# EAGLE schematic mega2560 (EAGLE 5.11)
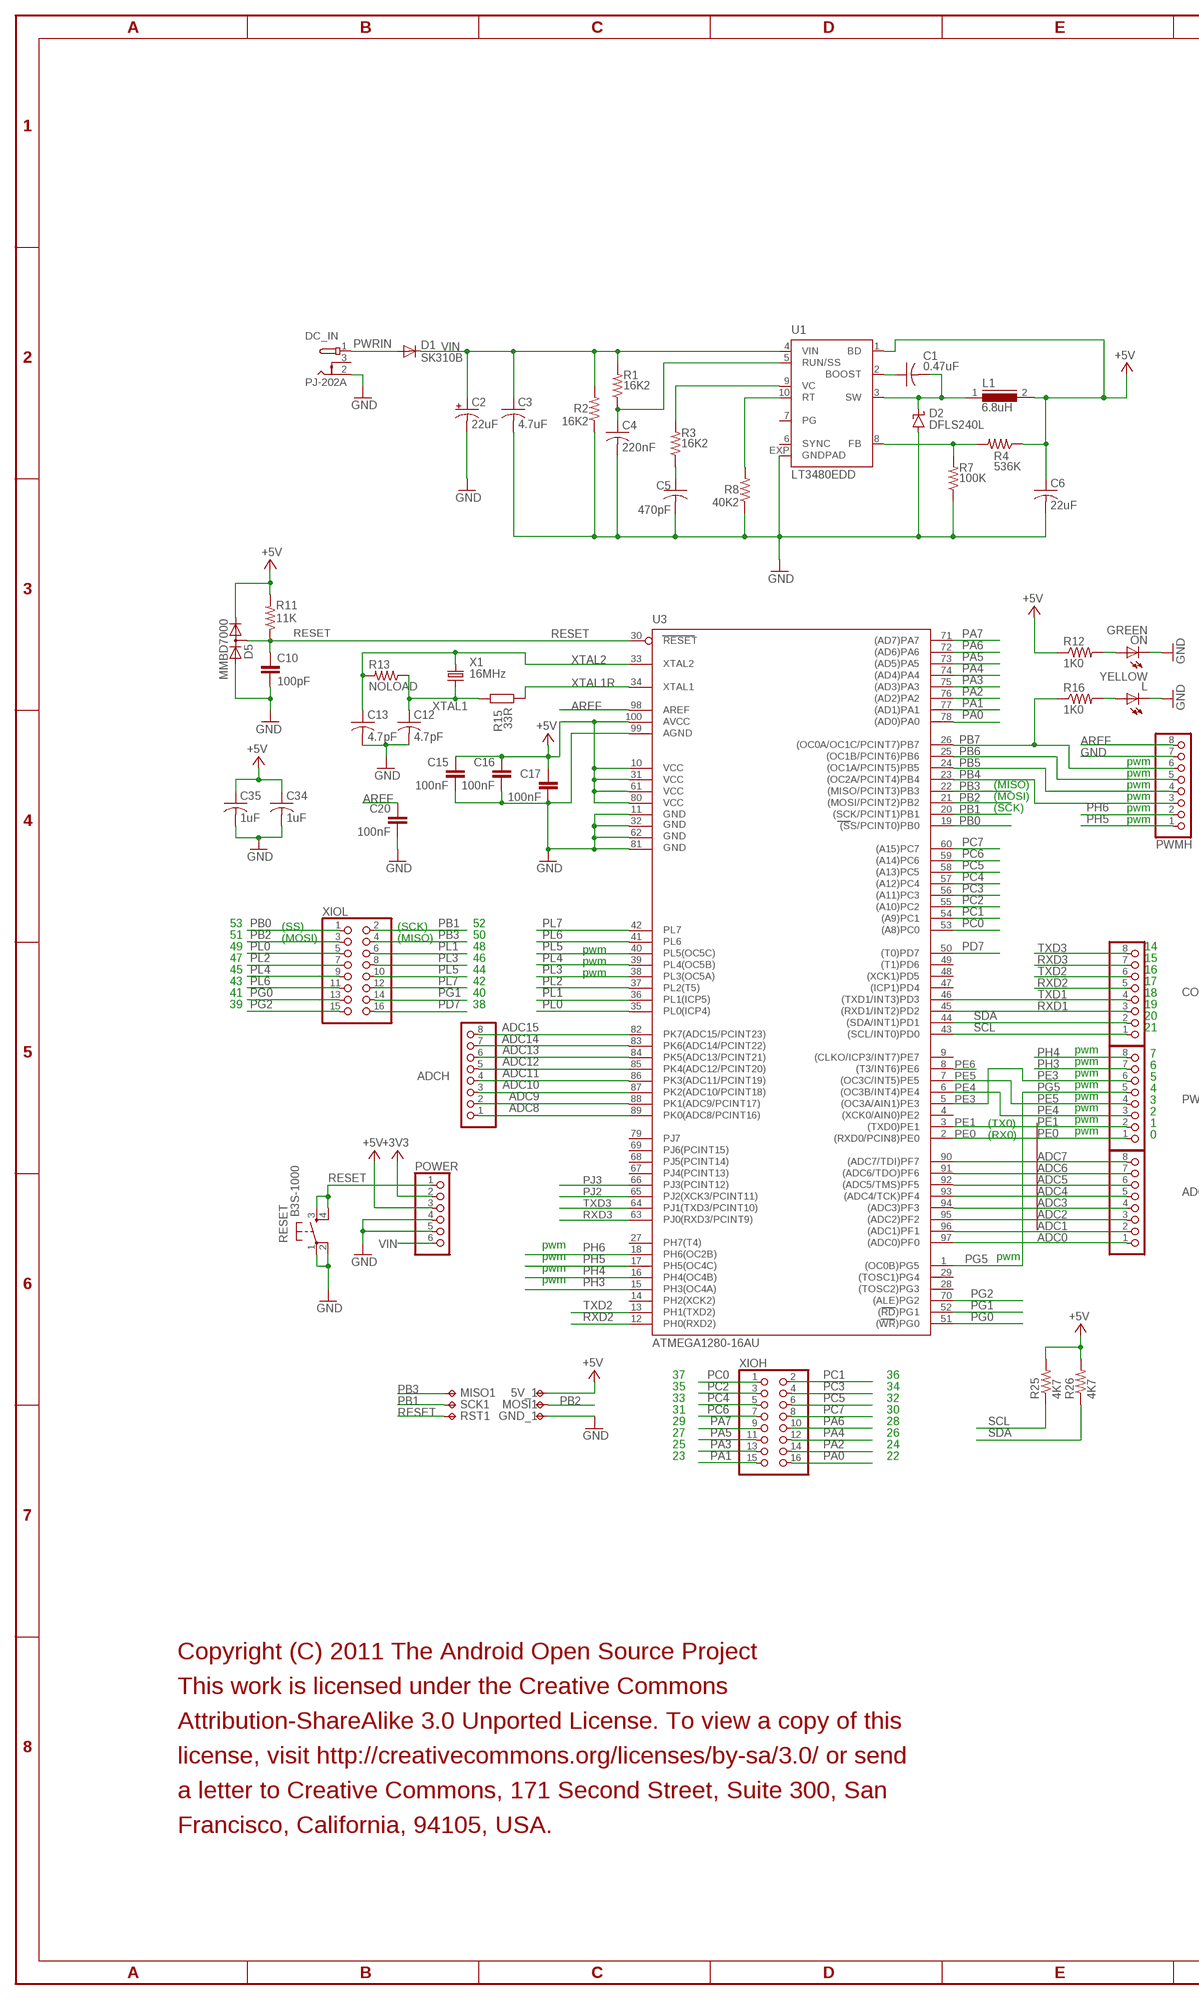
[diagram p0: schematic, sheet 1, part 1 of 2]
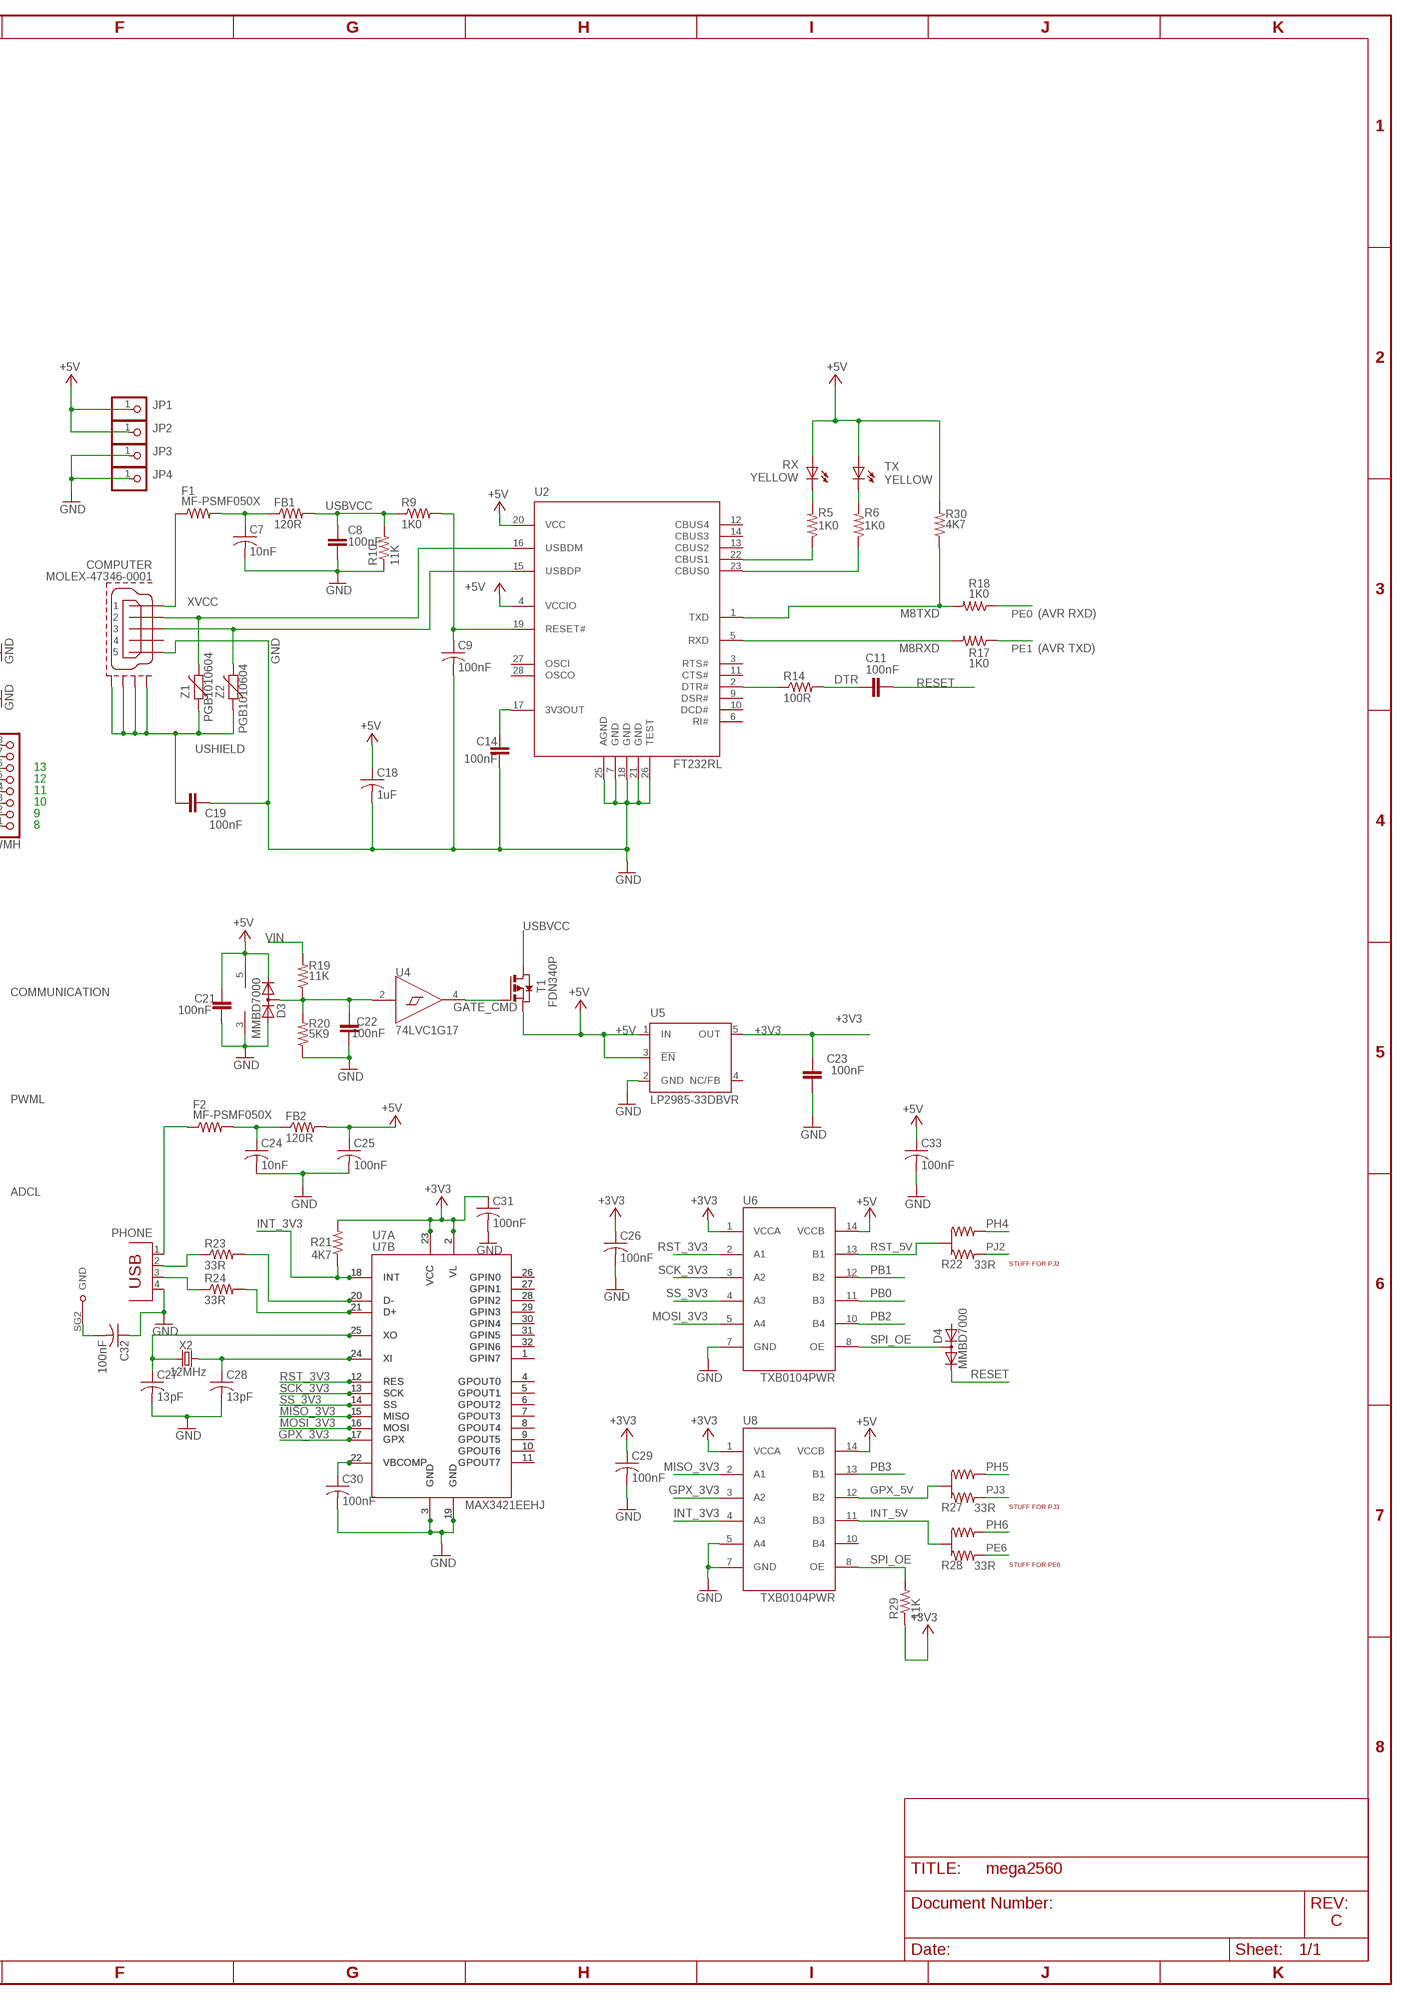
[diagram p1: schematic, sheet 1, part 2 of 2]

## Parts
5V_1  TPTP16R  [TP16R]
ADCH  PINHD-1X8  [1X08]
ADCL  PINHD-1X8  [1X08]
C1  0.47uF  C-USC0603  [C0603]
C2  22uF  CPOL-USF  [PANASONIC_F]
C3  4.7uF  C-USC1206  [C1206]
C4  220nF  C-USC0603  [C0603]
C5  470pF  C-USC0402  [C0402]
C6  22uF  C-USC1206  [C1206]
C7  10nF  C-USC0402  [C0402]
C8  100nF  C-EUC0402  [C0402]
C9  100nF  C-USC0402  [C0402]
C10  100pF  C-EUC0402  [C0402]
C11  100nF  C-EUC0402  [C0402]
C12  4.7pF  C-USC0402  [C0402]
C13  4.7pF  C-USC0402  [C0402]
C14  100nF  C-EUC0402  [C0402]
C15  100nF  C-EUC0402  [C0402]
C16  100nF  C-EUC0402  [C0402]
C17  100nF  C-EUC0402  [C0402]
C18  1uF  C-USC0603  [C0603]
C19  100nF  C-EUC0402  [C0402]
C20  100nF  C-EUC0402  [C0402]
C21  100nF  C-EUC0402  [C0402]
C22  100nF  C-EUC0402  [C0402]
C23  100nF  C-EUC0402  [C0402]
C24  10nF  C-USC0402  [C0402]
C25  100nF  C-USC0402  [C0402]
C26  100nF  C-USC0402  [C0402]
C27  13pF  C-USC0402  [C0402]
C28  13pF  C-USC0402  [C0402]
C29  100nF  C-USC0402  [C0402]
C30  100nF  C-USC0402  [C0402]
C31  100nF  C-USC0402  [C0402]
C32  100nF  C-USC0402  [C0402]
C33  100nF  C-USC0402  [C0402]
C34  1uF  C-USC0603  [C0603]
C35  1uF  C-USC0603  [C0603]
COMMUNICATION  PINHD-1X8  [1X08]
COMPUTER  MOLEX-47346-0001  [MOLEX-47364-0001]
D1  SK310B  DIODE-SMB  [SMB]
D2  DFLS240L  [SOD123PWR]
D3  MMBD7000  BAV199W  [SC70-3-R]
D4  MMBD7000  BAV199W  [SC70-3-R]
D5  MMBD7000  BAV199W  [SC70-3-R]
DC_IN  PJ-202A  [DC21]
F1  MF-PSMF050X  R-US_R0805  [R0805]
F2  MF-PSMF050X  R-US_R0805  [R0805]
FB1  120R  R-US_R0603  [R0603]
FB2  120R  R-US_R0603  [R0603]
GND_1  TPTP16R  [TP16R]
JP1  PINHD-1X1  [1X01]
JP2  PINHD-1X1  [1X01]
JP3  PINHD-1X1  [1X01]
JP4  PINHD-1X1  [1X01]
L  YELLOW  LEDCHIP-LED0603  [CHIP-LED0603]
L1  6.8uH  DR74  [DR74]
MISO1  TPTP16SQ  [TP16SQ]
MOSI1  TPTP16R  [TP16R]
ON  GREEN  LEDCHIP-LED0603  [CHIP-LED0603]
PHONE  PN87520  [PN87520]
POWER  PINHD-1X6  [1X06]
PWMH  PINHD-1X8  [1X08]
PWML  PINHD-1X8  [1X08]
R1  16K2  R-US_R0402  [R0402]
R2  16K2  R-US_R0402  [R0402]
R3  16K2  R-US_R0402  [R0402]
R4  536K  R-US_R0402  [R0402]
R5  1K0  R-US_R0402  [R0402]
R6  1K0  R-US_R0402  [R0402]
R7  100K  R-US_R0402  [R0402]
R8  40K2  R-US_R0402  [R0402]
R9  1K0  R-US_R0402  [R0402]
R10  11K  R-US_R0402  [R0402]
R11  11K  R-US_R0402  [R0402]
R12  1K0  R-US_R0402  [R0402]
R13  NOLOAD  R-US_R0402  [R0402]
R14  100R  R-US_R0402  [R0402]
R15  33R  R-EU_R0402  [R0402]
R16  1K0  R-US_R0402  [R0402]
R17  1K0  R-US_R0402  [R0402]
R18  1K0  R-US_R0402  [R0402]
R19  11K  R-US_R0402  [R0402]
R20  5K9  R-US_R0402  [R0402]
R21  4K7  R-US_R0402  [R0402]
R22  33R  J0402  [J0402]
R23  33R  R-US_R0402  [R0402]
R24  33R  R-US_R0402  [R0402]
R25  4K7  R-US_R0402  [R0402]
R26  4K7  R-US_R0402  [R0402]
R27  33R  J0402  [J0402]
R28  33R  J0402  [J0402]
R29  11K  R-US_R0402  [R0402]
R30  4K7  R-US_R0402  [R0402]
RESET  B3S-1000  [B3S-10XX]
RST1  TPTP16R  [TP16R]
RX  YELLOW  LEDCHIP-LED0603  [CHIP-LED0603]
SCK1  TPTP16R  [TP16R]
T1  FDN340P  PMOSSOT23  [SOT-23]
TX  YELLOW  LEDCHIP-LED0603  [CHIP-LED0603]
U1  LT3480EDD  LT3480*LT*  [LT-DD-10P-3MMX3MM-SLUG]
U2  FT232R  [SSOP28]
U3  ATMEGA1280-16AU  [TQFP100]
U4  74LVC1G17  [SOT-553]
U5  LP2985-33DBVR  TPS77033  [SOT23-DBV]
U6  TXB0104PWR  [TSSOP14]
U7A  MAX3421EEHJ  [TQFP32-05]
U7B  MAX3421EETJ  [TQFN-32]
U8  TXB0104PWR  [TSSOP14]
X1  16MHz  XTAL5032  [XTAL5032]
X2  12MHz  XTAL5032  [XTAL5032]
XIOH  PINHD-2X8  [2X08]
XIOL  PINHD-2X8  [2X08]
Z1  PGB1010604  VARISTORCN0603  [CT/CN0603]
Z2  PGB1010604  VARISTORCN0603  [CT/CN0603]

## Nets
+3V3: C23.2 C26.1 C29.1 C31.1 POWER.2 R21.2 R29.1 U5.5(OUT) U6.1(VCCA) U7A.2(VL) U7A.23(VCC) U7B.2(VL) U7B.23(VCC) U8.1(VCCA)
+5V: 5V_1.TP C6.1 C15.1 C16.1 C17.1 C18.1 C21.2 C25.1 C33.1 C34.1 C35.1 D3.2(C) D5.2(C) FB2.2 JP1.1 JP2.1 L1.2 POWER.3 R4.1 R11.2 R12.1 R25.2 R26.2 R30.2 RX.A T1.2(S) TX.A U1.1(BD) U2.4(VCCIO) U2.20(VCC) U3.10(VCC) U3.31(VCC1) U3.61(VCC2) U3.80(VCC3) U3.100(AVCC) U4.5(VCC) U5.1(IN) U5.3(!EN) U6.14(VCCB) U8.14(VCCB)
ADC0: ADCL.1 U3.97((ADC0)PF0)
ADC1: ADCL.2 U3.96((ADC1)PF1)
ADC2: ADCL.3 U3.95((ADC2)PF2)
ADC3: ADCL.4 U3.94((ADC3)PF3)
ADC4: ADCL.5 U3.93((ADC4/TCK)PF4)
ADC5: ADCL.6 U3.92((ADC5/TMS)PF5)
ADC6: ADCL.7 U3.91((ADC6/TDO)PF6)
ADC7: ADCL.8 U3.90((ADC7/TDI)PF7)
ADC8: ADCH.1 U3.89(PK0(ADC8/PCINT16))
ADC9: ADCH.2 U3.88(PK1(ADC9/PCINT17))
ADC10: ADCH.3 U3.87(PK2(ADC10/PCINT18))
ADC11: ADCH.4 U3.86(PK3(ADC11/PCINT19))
ADC12: ADCH.5 U3.85(PK4(ADC12/PCINT20))
ADC13: ADCH.6 U3.84(PK5(ADC13/PCINT21))
ADC14: ADCH.7 U3.83(PK6(ADC14/PCINT22))
ADC15: ADCH.8 U3.82(PK7(ADC15/PCINT23))
AREF: C20.1 PWMH.8 U3.98(AREF)
CMP: C22.2 D3.3(AC) R19.1 R20.2 U4.2(A)
D+: COMPUTER.3 U2.15(USBDP) Z2.2
D-: COMPUTER.2 U2.16(USBDM) Z1.2
DTR: C11.1 R14.2
GATE_CMD: T1.3(G) U4.4(Y)
GND: C2.- C3.2 C4.2 C5.2 C6.2 C7.2 C8.2 C9.2 C10.2 C12.2 C13.2 C14.2 C15.2 C16.2 C17.2 C18.2 C19.2 C20.2 C21.1 C22.1 C23.1 C24.2 C25.2 C26.2 C27.2 C28.2 C29.2 C30.2 C31.2 C32.1 C33.2 C34.2 C35.2 COMPUTER.5 D2.A D3.1(A) D5.1(A) DC_IN.2 GND_1.TP JP3.1 JP4.1 L.C ON.C PHONE.4 POWER.4 POWER.5 PWMH.7 R2.1 R7.1 R8.1 R10.1 R20.1 RESET.1(P) RESET.2(P1) U1.EXP(GNDPAD) U2.7(GND) U2.18(GND) U2.21(GND) U2.25(AGND) U2.26(TEST) U3.11(GND) U3.32(GND1) U3.62(GND2) U3.81(GND3) U3.99(AGND) U4.3(GND) U5.2(GND) U6.7(GND) U7A.3(GND) U7A.19(GND) U7B.3(GND) U7B.19(GND) U8.5(A4) U8.7(GND)
GPX_3V3: U7A.17(GPX) U7B.17(GPX) U8.3(A2)
GPX_5V: R27.2(C) U8.12(B2)
INT_3V3: R21.1 U7A.18(INT) U7B.18(INT) U8.4(A3)
INT_5V: R28.2(C) U8.11(B3)
M8RXD: R17.2 U2.5(RXD)
M8TXD: R18.2 R30.1 U2.1(TXD)
MISO_3V3: U7A.15(MISO) U7B.15(MISO) U8.2(A1)
MOSI_3V3: U6.5(A4) U7A.16(MOSI) U7B.16(MOSI)
N$1: C32.2 PHONE.SG2(GND)
N$2: L.A R16.2
N$3: ON.A R12.2
N$4: R6.2 TX.C
N$5: R5.2 RX.C
N$6: C5.1 R3.1
N$7: U7A.26(GPIN0) U7B.26(GPIN0)
N$8: U7A.27(GPIN1) U7B.27(GPIN1)
N$9: U7A.28(GPIN2) U7B.28(GPIN2)
N$10: PHONE.2 R23.1
N$11: PHONE.3 R24.1
N$12: R23.2 U7A.20(D-) U7B.20(D-)
N$13: R24.2 U7A.21(D+) U7B.21(D+)
N$14: F2.1 PHONE.1
N$15: C28.1 U7A.24(XI) U7B.24(XI) X2.1
N$16: C27.1 U7A.25(XO) U7B.25(XO) X2.2
N$17: C7.1 F1.2 FB1.1
N$18: C24.1 F2.2 FB2.1
N$19: C14.1 U2.17(3V3OUT)
N$20: U7A.29(GPIN3) U7B.29(GPIN3)
N$21: R14.1 U2.2(DTR#)
N$22: R5.1 U2.22(CBUS1)
N$23: R6.1 U2.23(CBUS0)
N$24: C9.1 R9.2 U2.19(RESET#)
N$25: U7A.30(GPIN4) U7B.30(GPIN4)
N$26: U7A.31(GPIN5) U7B.31(GPIN5)
N$27: U7A.32(GPIN6) U7B.32(GPIN6)
N$28: U7A.1(GPIN7) U7B.1(GPIN7)
N$29: U7A.4(GPOUT0) U7B.4(GPOUT0)
N$30: U7A.5(GPOUT1) U7B.5(GPOUT1)
N$31: U7A.6(GPOUT2) U7B.6(GPOUT2)
N$32: U7A.7(GPOUT3) U7B.7(GPOUT3)
N$33: U7A.8(GPOUT4) U7B.8(GPOUT4)
N$34: U7A.9(GPOUT5) U7B.9(GPOUT5)
N$35: U7A.10(GPOUT6) U7B.10(GPOUT6)
N$36: U7A.11(GPOUT7) U7B.11(GPOUT7)
N$39: C30.1 U7A.22(VBCOMP) U7B.22(VBCOMP)
PA0: U3.78((AD0)PA0) XIOH.16
PA1: U3.77((AD1)PA1) XIOH.15
PA2: U3.76((AD2)PA2) XIOH.14
PA3: U3.75((AD3)PA3) XIOH.13
PA4: U3.74((AD4)PA4) XIOH.12
PA5: U3.73((AD5)PA5) XIOH.11
PA6: U3.72((AD6)PA6) XIOH.10
PA7: U3.71((AD7)PA7) XIOH.9
PB0: U3.19((SS/PCINT0)PB0) U6.11(B3) XIOL.1
PB1: SCK1.TP U3.20((SCK/PCINT1)PB1) U6.12(B2) XIOL.2
PB2: MOSI1.TP U3.21((MOSI/PCINT2)PB2) U6.10(B4) XIOL.3
PB3: MISO1.TP U3.22((MISO/PCINT3)PB3) U8.13(B1) XIOL.4
PB4: PWMH.3 U3.23((OC2A/PCINT4)PB4)
PB5: PWMH.4 U3.24((OC1A/PCINT5)PB5)
PB6: PWMH.5 U3.25((OC1B/PCINT6)PB6)
PB7: PWMH.6 R16.1 U3.26((OC0A/OC1C/PCINT7)PB7)
PC0: U3.53((A8)PC0) XIOH.1
PC1: U3.54((A9)PC1) XIOH.2
PC2: U3.55((A10)PC2) XIOH.3
PC3: U3.56((A11)PC3) XIOH.4
PC4: U3.57((A12)PC4) XIOH.5
PC5: U3.58((A13)PC5) XIOH.6
PC6: U3.59((A14)PC6) XIOH.7
PC7: U3.60((A15)PC7) XIOH.8
PD7: U3.50((T0)PD7) XIOL.16
PE0: PWML.1 R18.1 U3.2((RXD0/PCIN8)PE0)
PE1: PWML.2 R17.1 U3.3((TXD0)PE1)
PE3: PWML.6 U3.5((OC3A/AIN1)PE3)
PE4: PWML.3 U3.6((OC3B/INT4)PE4)
PE5: PWML.4 U3.7((OC3C/INT5)PE5)
PE6: R28.3 U3.8((T3/INT6)PE6)
PG0: U3.51((WR)PG0) XIOL.13
PG1: U3.52((RD)PG1) XIOL.14
PG2: U3.70((ALE)PG2) XIOL.15
PG5: PWML.5 U3.1((OC0B)PG5)
PH3: PWML.7 U3.15(PH3(OC4A))
PH4: PWML.8 R22.1 U3.16(PH4(OC4B))
PH5: PWMH.1 R27.1 U3.17(PH5(OC4C))
PH6: PWMH.2 R28.1 U3.18(PH6(OC2B))
PJ2: R22.3 U3.65(PJ2(XCK3/PCINT11))
PJ3: R27.3 U3.66(PJ3(PCINT12))
PL0: U3.35(PL0(ICP4)) XIOL.5
PL1: U3.36(PL1(ICP5)) XIOL.6
PL2: U3.37(PL2(T5)) XIOL.7
PL3: U3.38(PL3(OC5A)) XIOL.8
PL4: U3.39(PL4(OC5B)) XIOL.9
PL5: U3.40(PL5(OC5C)) XIOL.10
PL6: U3.41(PL6) XIOL.11
PL7: U3.42(PL7) XIOL.12
PWRIN: D1.A DC_IN.1
RESET: C10.1 C11.2 D4.2(C) D5.3(AC) POWER.1 R11.1 RESET.3(S) RESET.4(S1) RST1.TP U3.30(RESET)
RST_3V3: U6.2(A1) U7A.12(RES) U7B.12(RES)
RST_5V: R22.2(C) U6.13(B1)
RUN_SS: C4.1 R1.1 U1.5(RUN/SS)
RXD1: COMMUNICATION.3 U3.45((RXD1/INT2)PD2)
RXD2: COMMUNICATION.5 U3.12(PH0(RXD2))
RXD3: COMMUNICATION.7 U3.63(PJ0(RXD3/PCINT9))
SCK_3V3: U6.3(A2) U7A.13(SCK) U7B.13(SCK)
SCL: COMMUNICATION.1 R25.1 U3.43((SCL/INT0)PD0)
SDA: COMMUNICATION.2 R26.1 U3.44((SDA/INT1)PD1)
SPI_OE: D4.3(AC) R29.2 U6.8(OE) U8.8(OE)
SS_3V3: U6.4(A3) U7A.14(SS) U7B.14(SS)
SW_RT: R8.2 U1.10(RT)
SW_VC: R3.2 U1.9(VC)
TXD1: COMMUNICATION.4 U3.46((TXD1/INT3)PD3)
TXD2: COMMUNICATION.6 U3.13(PH1(TXD2))
TXD3: COMMUNICATION.8 U3.64(PJ1(TXD3/PCINT10))
USBVCC: C8.1 FB1.2 R9.1 R10.2 T1.1(D)
USHIELD: C19.1 COMPUTER.GND1 COMPUTER.GND2 COMPUTER.GND3 COMPUTER.GND4 Z1.1 Z2.1
VBOOST: C1.1 U1.2(BOOST)
VFB: R4.2 R7.2 U1.8(FB)
VIN: C2.+ C3.1 D1.C POWER.6 R1.2 R2.2 R19.2 U1.4(VIN)
VSW: C1.2 D2.K L1.1 U1.3(SW)
XTAL1: C12.1 R13.1 R15.2 X1.1
XTAL1R: R15.1 U3.34(XTAL1)
XTAL2: C13.1 R13.2 U3.33(XTAL2) X1.2
XVCC: COMPUTER.1 F1.1
Unconnected: COMPUTER.4 D4.1(A) DC_IN.3 PHONE.SG1(GND) U1.6(SYNC) U1.7(PG) U2.3(RTS#) U2.6(RI#) U2.9(DSR#) U2.10(DCD#) U2.11(CTS#) U2.12(CBUS4) U2.13(CBUS2) U2.14(CBUS3) U2.27(OSCI) U2.28(OSCO) U3.4((XCK0/AIN0)PE2) U3.9((CLKO/ICP3/INT7)PE7) U3.14(PH2(XCK2)) U3.27(PH7(T4)) U3.28((TOSC2)PG3) U3.29((TOSC1)PG4) U3.47((ICP1)PD4) U3.48((XCK1)PD5) U3.49((T1)PD6) U3.67(PJ4(PCINT13)) U3.68(PJ5(PCINT14)) U3.69(PJ6(PCINT15)) U3.79(PJ7) U5.4(NC/FB) U8.10(B4)

## Notes on the sheet
- (AVR RXD)
- (AVR TXD)
- pwm | FT232RL
- 13
- pwm
- 12
- (MISO) | pwm
- 11
- (MOSI) | pwm
- 10
- (SCK) | pwm
- 9
- pwm
- 8
- 53 | (SS) | (SCK) | 52
- 51 | (MOSI) | (MISO) | 50
- 49 | 48 | pwm | 14
- 47 | 46 | pwm | 15
- 45 | 44 | pwm | 16
- 43 | 42 | 17
- 41 | 40 | 18
- 39 | 38 | 19
- 20
- 21
- pwm
- 7
- pwm
- 6
- pwm
- 5
- pwm
- 4
- pwm
- 3
- pwm
- 2
- pwm
- (TX0) | 1
- pwm
- (RX0) | 0
- pwm
- pwm | pwm
- STUFF FOR PJ2
- pwm
- pwm
- 37 | 36
- 35 | 34
- 33 | 32
- 31 | 30
- 29 | 28
- 27 | 26
- 25 | 24
- 23 | 22
- STUFF FOR PJ3
- STUFF FOR PE6
- Copyright (C) 2011 The Android Open Source Project
- This work is licensed under the Creative Commons
- Attribution-ShareAlike 3.0 Unported License. To view a copy of this
- license, visit http://creativecommons.org/licenses/by-sa/3.0/ or send
- a letter to Creative Commons, 171 Second Street, Suite 300, San
- Francisco, California, 94105, USA.
- C

## Library data of the parts
5V_1 GND_1 MISO1 MOSI1 RST1 SCK1 = testpad:TP
ADCH ADCL COMMUNICATION PWMH PWML = pinhead:PINHD-1X8: PIN HEADER
C1 C3-C7 C9 C12 C13 C18 C24-C35 = rcl:C-US: CAPACITOR, American symbol
C2 = rcl:CPOL-US: POLARIZED CAPACITOR, American symbol
C8 C21 = rcl:C-EU: CAPACITOR, European symbol
C10 C11 C14-C17 C19 C20 C22 C23 = SmartPrj:C-EU: CAPACITOR, European symbol
COMPUTER = usb_con-update:MOLEX-47346-0001: MICRO USB B, BOTTOM MOUNT
D1 = diode:DIODE-: DIODE
D2 = bibaja:DFLS240L: Schottky Diode 2A 0.5V
D3-D5 = diode:BAV199: DIODE low-leakage double diode
DC_IN = cui:PJ-202A: CUI Stack 2.1mm DC Power Jack
F1 F2 FB1 FB2 R1-R14 R16-R21 R23-R26 R29 R30 = rcl:R-US_: RESISTOR, American symbol
JP1-JP4 = pinhead:PINHD-1X1: PIN HEADER
L ON RX TX = led:LED: LED OSRAM: - CHIPLED LG R971, LG N971, LY N971, LG Q971, LY Q971, LO R971, LY R971 LH N974, LH R974 LS Q976, LO Q976, LY Q976 LO Q996 - Hyper CHIPLED LW Q18S LB Q993, LB Q99A, LB R99A - SideLED LS A670, LO A670, LY A670, LG A670, LP A670 LB A673, LV A673, LT A673, LW A673 LH A674 LY A675 LS A676, LA A676, LO A676, LY A676, LW A676 LS A679, LY A679, LG A679 - Hyper Micro SIDELED® LS Y876, LA Y876, LO Y876, LY Y876 LT Y87S - SmartLED LW L88C, LW L88S LB L89C, LB L89S, LG L890 LS L89K, LO L89K, LY L89K LS L896, LA L896, LO L896, LY L896 - TOPLED LS T670, LO T670, LY T670, LG T670, LP T670 LSG T670, LSP T670, LSY T670, LOP T670, LYG T670 LG T671, LOG T671, LSG T671 LB T673, LV T673, LT T673, LW T673 LH T674 LS T676, LA T676, LO T676, LY T676, LB T676, LH T676, LSB T676, LW T676 LB T67C, LV T67C, LT T67C, LS T67K, LO T67K, LY T67K, LW E67C LS E67B, LA E67B, LO E67B, LY E67B, LB E67C, LV E67C, LT E67C LW T67C LS T679, LY T679, LG T679 LS T770, LO T770, LY T770, LG T770, LP T770 LB T773, LV T773, LT T773, LW T773 LH T774 LS E675, LA E675, LY E675, LS T675 LS T776, LA T776, LO T776, LY T776, LB T776 LHGB T686 LT T68C, LB T68C - Hyper Mini TOPLED® LB M676 - Mini TOPLED Santana® LG M470 LS M47K, LO M47K, LY M47K Source: http://www.osram.convergy.de LUXEON: - LUMILED® LXK2-PW12-R00, LXK2-PW12-S00, LXK2-PW14-U00, LXK2-PW14-V00 LXK2-PM12-R00, LXK2-PM12-S00, LXK2-PM14-U00 LXK2-PE12-Q00, LXK2-PE12-R00, LXK2-PE12-S00, LXK2-PE14-T00, LXK2-PE14-U00 LXK2-PB12-K00, LXK2-PB12-L00, LXK2-PB12-M00, LXK2-PB14-N00, LXK2-PB14-P00, LXK2-PB14-Q00 LXK2-PR12-L00, LXK2-PR12-M00, LXK2-PR14-Q00, LXK2-PR14-R00 LXK2-PD12-Q00, LXK2-PD12-R00, LXK2-PD12-S00 LXK2-PH12-R00, LXK2-PH12-S00 LXK2-PL12-P00, LXK2-PL12-Q00, LXK2-PL12-R00 Source: www.luxeon.com KINGBRIGHT: KA-3528ASYC Source: www.kingbright.com
L1 = inductors:DR74: High Power Density, High Efficiency, Shielded Inductors Source: coiltronics_dr_series.pdf
PHONE = con-berg:PN87520: BERG
POWER = pinhead:PINHD-1X6: PIN HEADER
R15 = SmartPrj:R-EU_: RESISTOR, European symbol
R22 R27 R28 = bibaja:J: Three terminal jumper made from two 0402, 0603, 0805, etc.
RESET = switch-omron:B3S-1000: Omron Surface Mount Switch, 160g operating force, 4.3mm actuator height, sealed for immersion cleaning
T1 = zetex:PMOSSOT23: MOS FET
U1 = Matt:LT3480
U2 = ftdi:FT232
U3 = atmel-2005:ATMEGA*: MICROCONTROLLER 64/128/256 Kbytes FLASH 4 Kbytes EEPROM 8 Kbytes SRAM 86 General Purpose I/O pins 12-channels16-bit PWM 4 x Serial USARTs 16-channels 10-bit A/D
U4 = bibaja:74LVC1G17: Single Schmitt-Trigger Buffer, 1.65-5.5V (Alternate part NL17SZ17)
U5 = texas:TPS770*: ULTRALOW-POWER 50-mA LOW-DROPOUT LINEAR REGULATORS 50-mA Low-Dropout Regulator Source: http://focus.ti.com/lit/ds/symlink/tps77001.pdf
U6 U8 = bibaja:TXB0104: 4-bit Bidirectional Voltage-Level Translator
U7A U7B = bibaja:MAX3421EE: MAX3421 SPI to USB Interface Chip
X1 X2 = bibaja:XTAL5032: Crystal, 5.0x3.2mm Oscilent.com 267 Series Kyocera CX5032 Series
XIOH XIOL = pinhead:PINHD-2X8: PIN HEADER
Z1 Z2 = varistor:VARISTOR: VARISTOR

## Net classes
0 default: width 0.152 mm, drill 0.305 mm, clearance 0.152 mm